# Altium schematic sheet EthernetRTL8211.SchDoc
size A4; SheetNumber: 8; SheetTotal: 16
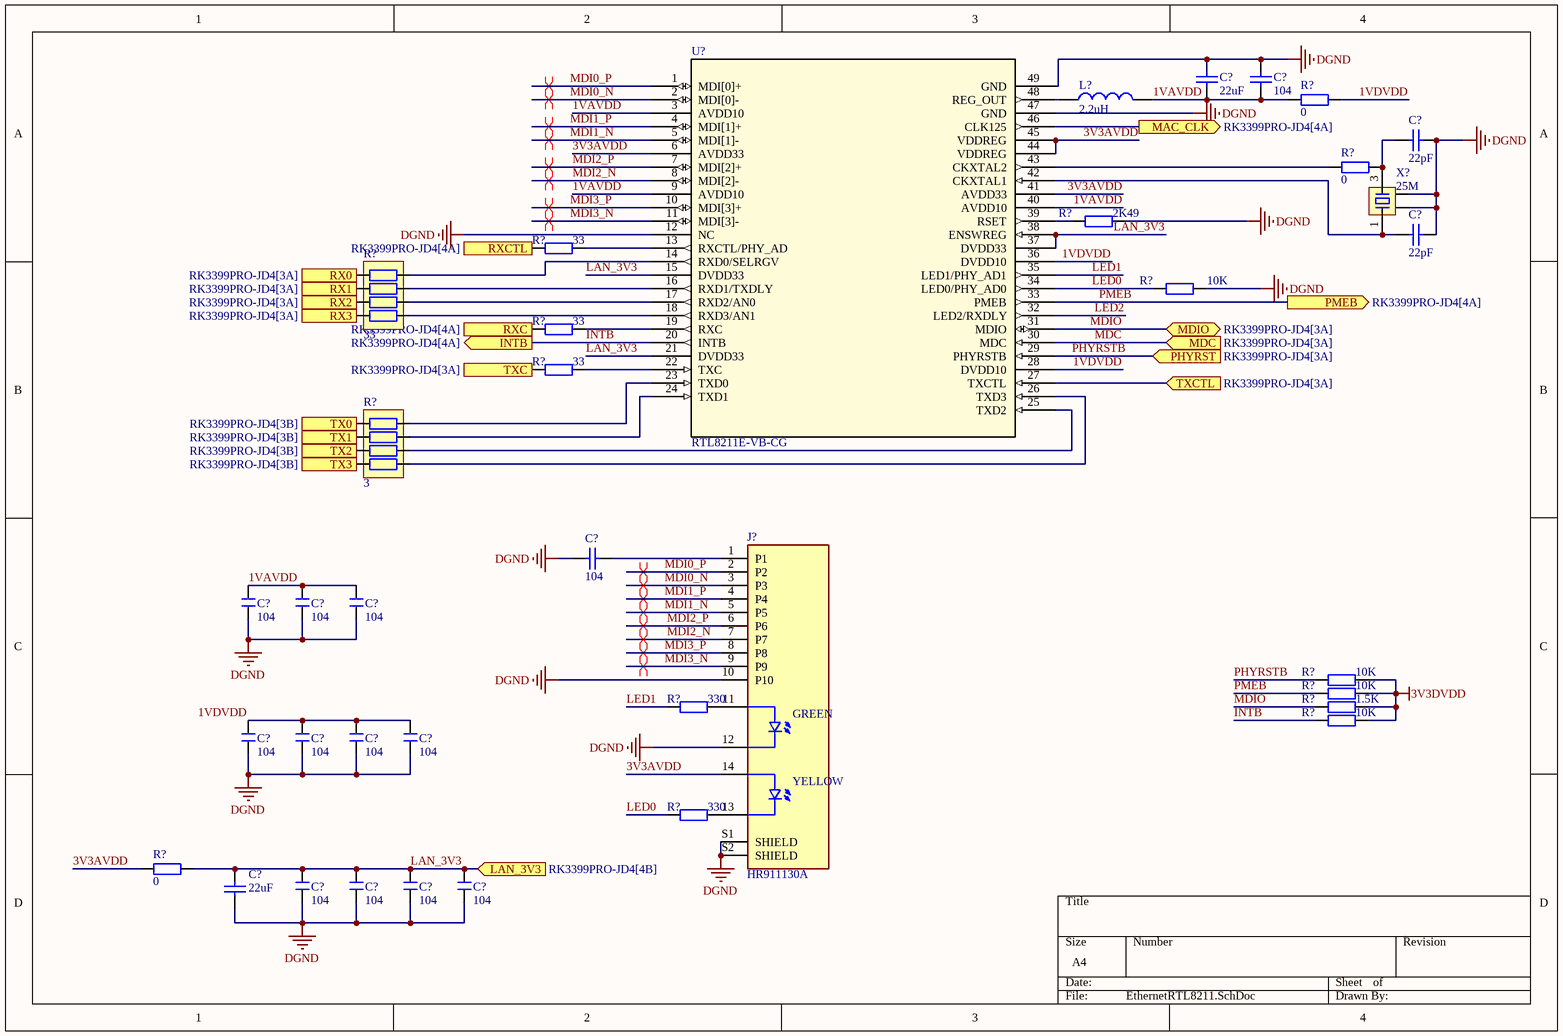
[diagram p0: EthernetRTL8211.SchDoc]

## Parts
(Parts that share a designator on the sheet are numbered #1, #2 ... from top to bottom, then left to right.)
C?#1  22uF  [0603_C]
C?#2  104  [0603_C]
C?#3  22pF  [0603_C]
C?#4  22pF  [0603_C]
C?#5  104  [0603_C]
C?#6  104  [C 0603_L]
C?#7  104  [C 0603_L]
C?#8  104  [C 0603_L]
C?#9  104  [C 0603_L]
C?#10  104  [C 0603_L]
C?#11  104  [C 0603_L]
C?#12  104  [C 0603_L]
C?#13  22uF  [0603_C]
C?#14  104  [C 0603_L]
C?#15  104  [C 0603_L]
C?#16  104  [C 0603_L]
C?#17  104  [C 0603_L]
J?  HR911130A  [HANRUN_HR911130A]
L?  2.2uH  [CD75]
R?#1  0  [R 0603_L]
R?#2  0  [R 0603_L]
R?#3  2K49  [R 0603_L]
R?#4  33  [R 0603_L]
R?#5  33  [RCA-8P4R-0603]
R?#6  10K  [R 0603_L]
R?#7  33  [R 0603_L]
R?#8  33  [R 0603_L]
R?#9  3  [RCA-8P4R-0603]
R?#10  10K  [R 0603_L]
R?#11  10K  [R 0603_L]
R?#12  330  [R 0603_L]
R?#13  1.5K  [R 0603_L]
R?#14  10K  [R 0603_L]
R?#15  330  [R 0603_L]
R?#16  0  [R 0603_L]
U?  RTL8211E-VB-CG  [QFN48 7X7_L]
X?  25M  [OSC 3225-4P]

## Ports
INTB (out, see RK3399PRO-JD4[4A]), LAN_3V3 (in, see RK3399PRO-JD4[4B]), MAC_CLK (out, see RK3399PRO-JD4[4A]), MDC (in, see RK3399PRO-JD4[3A]), MDIO (bidir, see RK3399PRO-JD4[3A]), PHYRST (in, see RK3399PRO-JD4[3A]), PMEB (out, see RK3399PRO-JD4[4A]), RX0 (in, see RK3399PRO-JD4[3A]), RX1 (in, see RK3399PRO-JD4[3A]), RX2 (in, see RK3399PRO-JD4[3A]), RX3 (in, see RK3399PRO-JD4[3A]), RXC (out, see RK3399PRO-JD4[4A]), RXCTL (out, see RK3399PRO-JD4[4A]), TX0 (in, see RK3399PRO-JD4[3B]), TX1 (in, see RK3399PRO-JD4[3B]), TX2 (in, see RK3399PRO-JD4[3B]), TX3 (in, see RK3399PRO-JD4[3B]), TXC (in, see RK3399PRO-JD4[3A]), TXCTL (in, see RK3399PRO-JD4[3A])

## Nets
3V3DVDD: R?#10.1 R?#11.1 R?#13.1 R?#14.1
DGND: C?#1.1 C?#2.1 C?#3.2 C?#4.2 C?#5.1 C?#6.1 C?#7.1 C?#8.1 C?#9.1 C?#10.1 C?#11.1 C?#12.1 C?#13.1 C?#14.1 C?#15.1 C?#16.1 C?#17.1 J?.10(P10) J?.12 J?.S1(SHIELD) J?.S2(SHIELD) R?#3.1 R?#6.1 U?.12(NC) U?.47(GND) U?.49(GND) X?.2 X?.4
1VAVDD: C?#1.2 C?#2.2 C?#6.2 C?#7.2 C?#8.2 L?.2 R?#1.2 U?.3(AVDD10) U?.9(AVDD10) U?.40(AVDD10)
1VDVDD: C?#9.2 C?#10.2 C?#11.2 C?#12.2 R?#1.1 U?.28(DVDD10) U?.36(DVDD10)
3V3AVDD: J?.14 R?#16.2 U?.6(AVDD33) U?.41(AVDD33) U?.44(VDDREG) U?.45(VDDREG)
INTB: R?#14.2 U?.20(INTB) ; port INTB
LAN_3V3: C?#13.2 C?#14.2 C?#15.2 C?#16.2 C?#17.2 R?#16.1 U?.15(DVDD33) U?.21(DVDD33) U?.37(DVDD33) U?.38(ENSWREG) ; port LAN_3V3
LED0: R?#6.2 R?#15.2 U?.34(LED0/PHY_AD0)
LED1: R?#12.2 U?.35(LED1/PHY_AD1)
LED2: U?.32(LED2/RXDLY)
MAC_CLK: U?.46(CLK125) ; port MAC_CLK
MDC: U?.30(MDC) ; port MDC
MDI0_N: J?.3(P3) U?.2(MDI[0]-)
MDI0_P: J?.2(P2) U?.1(MDI[0]+)
MDI1_N: J?.5(P5) U?.5(MDI[1]-)
MDI1_P: J?.4(P4) U?.4(MDI[1]+)
MDI2_N: J?.7(P7) U?.8(MDI[2]-)
MDI2_P: J?.6(P6) U?.7(MDI[2]+)
MDI3_N: J?.9(P9) U?.11(MDI[3]-)
MDI3_P: J?.8(P8) U?.10(MDI[3]+)
MDIO: R?#13.2 U?.31(MDIO) ; port MDIO
PHYRSTB: R?#10.2 U?.29(PHYRSTB) ; port PHYRST
PMEB: R?#11.2 U?.33(PMEB) ; port PMEB
RX0: R?#5.1 ; port RX0
RX1: R?#5.2 ; port RX1
RX2: R?#5.3 ; port RX2
RX3: R?#5.4 ; port RX3
RXC: R?#7.2 ; port RXC
RXCTL: R?#4.2 ; port RXCTL
TX0: R?#9.1 ; port TX0
TX1: R?#9.2 ; port TX1
TX2: R?#9.3 ; port TX2
TX3: R?#9.4 ; port TX3
TXC: R?#8.2 ; port TXC
TXCTL: U?.27(TXCTL) ; port TXCTL
NetC?#3_1: C?#3.1 R?#2.1 X?.3
NetC?#4_1: C?#4.1 U?.42(CKXTAL1) X?.1
NetC?#5_2: C?#5.2 J?.1(P1)
NetJ?_11: J?.11 R?#12.1
NetJ?_13: J?.13 R?#15.1
NetL?_1: L?.1 U?.48(REG_OUT)
NetR?#2_2: R?#2.2 U?.43(CKXTAL2)
NetR?#3_2: R?#3.2 U?.39(RSET)
NetR?#4_1: R?#4.1 U?.13(RXCTL/PHY_AD)
NetR?#5_5: R?#5.5 U?.18(RXD3/AN1)
NetR?#5_6: R?#5.6 U?.17(RXD2/AN0)
NetR?#5_7: R?#5.7 U?.16(RXD1/TXDLY)
NetR?#5_8: R?#5.8 U?.14(RXD0/SELRGV)
NetR?#7_1: R?#7.1 U?.19(RXC)
NetR?#8_1: R?#8.1 U?.22(TXC)
NetR?#9_5: R?#9.5 U?.26(TXD3)
NetR?#9_6: R?#9.6 U?.25(TXD2)
NetR?#9_7: R?#9.7 U?.24(TXD1)
NetR?#9_8: R?#9.8 U?.23(TXD0)

## Layout directives
differential pair: MDI0_N, MDI0_P, MDI1_N, MDI1_P, MDI2_N, MDI2_P, MDI3_N, MDI3_P

## Notes on the sheet
- (in symbol HR911130A) GREEN; YELLOW

## Library data of the parts
C?#1-C?#5 C?#13 = Cap: Capacitor; Published: 8-Jun-2000; LatestRevisionDate: 17-Jul-2002; LatestRevisionNote: Re-released for DXP Platform.; PackageReference: RAD-0.3; Publisher: Altium Limited
  C?#1 C?#13: Value: 22uF
  C?#2 C?#5: Value: 104
  C?#3 C?#4: Value: 22pF
C?#6-C?#12 C?#14-C?#17 = C: 贴片电容; BOM名称: 无极性贴片电容; 淘宝ID: 封装库来自淘宝 ID：黄晶宝石; 联系售后，技术支持: https://shop463601444.taobao.com; 唯一出售店铺网址: https://shop463601444.taobao.com
J? = HR911130A: MF: hanrun; SnapEDA_Link: https://www.snapeda.com/parts/HR911130A/HanRun/view-part/?ref=snap; MP: HR911130A; Price: None; Package: None; Check_prices: https://www.snapeda.com/parts/HR911130A/HanRun/view-part/?ref=eda; Value: *; Availability: Not in stock
L? = L: 小功率贴片电感; 淘宝ID: 封装库来自淘宝 ID：黄晶宝石; 封装库来自淘宝卖家 ID：黄晶宝石: 其他店铺购入均为盗版，不享受售后技术支持服务，请立即申请退款; BOM名称: 小功率贴片电感; 联系售后: https://shop463601444.taobao.com
R?#1-R?#4 R?#6-R?#8 R?#10-R?#16 = R: 贴片电阻; 版权归属: 来自淘宝 ID：黄晶宝石; 封装库来自淘宝卖家 ID：黄晶宝石: 其他店铺购入均为盗版，不享受售后技术支持服务，请立即申请退款; BOM名称: 贴片电阻; 联系售后: https://shop463601444.taobao.com
R?#5 R?#9 = R-8P4R: 贴片排阻; BOM名称: 贴片网络排阻; 版权归属: 封装库来自淘宝 ID：黄晶宝石; 联系售后: https://shop463601444.taobao.com
U? = RTL8211E-VB-CG: No Description Available; Mfr_Name: Realtek; Copyright: Copyright (C) 2023 Ultra Librarian. All rights reserved.; Manufacturer_Part_Number: RTL8211E-VB-CG; RefDes: RefDes; Type: DEV
X? = XTAL-4P: 4脚无源晶振; 版权归属: 封装库来自淘宝卖家 ID：黄晶宝石; BOM名称: 4脚无源晶振; 学习资源: https://shop463601444.taobao.com